# Altium schematic sheet CAN_Transceiver.SchDoc
size A
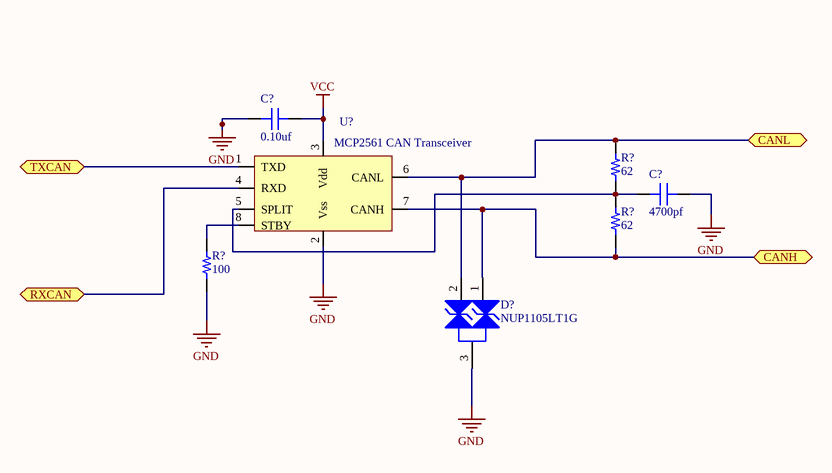
[diagram p0: CAN_Transceiver.SchDoc]

## Parts
(Parts that share a designator on the sheet are numbered #1, #2 ... from top to bottom, then left to right.)
C?#1  value 0.10uf  [CAP 0603/1608]  (hidden comment: Capacitor MLCC 0.10uf 50V CAP 0603/1608)
C?#2  value 4700pf  [CAP 0603/1608]  (hidden comment: Capacitor MLCC 4700pf 50V CAP 0603/1608)
D?  NUP1105LT1G  [SOT-23 (TO-236)]
R?#1  value 62  [RES 0603/1608]  (hidden comment: Resistor 62 0603 1/10W 5%)
R?#2  value 62  [RES 0603/1608]  (hidden comment: Resistor 62 0603 1/10W 5%)
R?#3  value 100  [RES 0603/1608]  (hidden comment: Resistor 100 0603 1/10W 10%)
U?  MCP2561 CAN Transceiver  [SOIC-8]

## Ports
CANH (bidir), CANL (bidir), RXCAN (bidir), TXCAN (bidir)

## Nets
GND: C?#1.1 C?#2.1 D?.3(K) R?#3.1 U?.2(Vss)
VCC: C?#1.2 U?.3(Vdd)
CANH: D?.1(K) R?#2.2 U?.7(CANH) ; port CANH
CANL: D?.2(K) R?#1.1 U?.6(CANL) ; port CANL
RXCAN: U?.4(RXD) ; port RXCAN
TXCAN: U?.1(TXD) ; port TXCAN
NetC?#2_2: C?#2.2 R?#1.2 R?#2.1 U?.5(SPLIT)
NetR?#3_2: R?#3.2 U?.8(STBY)

## Library data of the parts
C?#1 = 943: Manufacturer_id: 1; idCapacitor: 943; Name: Cap_0.10uf_50V_CAP 0603/1608; Dielectric: Ceramic; Created_By: Nick Mah; Drawer_id: 1; Voltage_Rating: 50V; Package: CAP 0603/1608; Created_Date: 10/20/2018
C?#2 = 929: Manufacturer_id: 1; idCapacitor: 929; Name: Cap_4700pf_50V_CAP 0603/1608; Dielectric: Ceramic; Created_By: Nick Mah; Drawer_id: 1; Voltage_Rating: 50V; Package: CAP 0603/1608; Created_Date: 10/20/2018
D? = 7: ESD Protection Diode; Manufacturer_id: 1; idDiode: 7; Name: SOT-23_350W_Zener; Value: TVS_24V; Type: Zener; Ic: 8A; Power: 350W; Drawer_id: 1; Num_Circuits: 1; Package: SOT-23; MfrPartNo: NUP1105LT1G; Link: https://www.digikey.com/product-detail/en/on-semiconductor/NUP1105LT1G/NUP1105LT1GOSCT-ND/2122067; ComponentLink1URL: https://www.digikey.com/product-detail/en/on-semiconductor/NUP1105LT1G/NUP1105LT1GOSCT-ND/2122067; Supplier1: Digikey; Supplier1PartNo: NUP1105LT1GOSCT-ND
R?#1 R?#2 = 1340: Manufacturer_id: 1; idResistor: 1340; Name: Res_62_0603_1/10W_5%; Created_By: Nick Mah; Supplier 1: Digi-Key; Drawer_id: 1; Tolerance: 5%; Power: 1/10W; Package: 0603; ComponentLink1Description: Datasheet; Created_Date: 2018-10-20
R?#3 = 2293: Manufacturer_id: 1; idResistor: 2293; Name: Res_100_0603_1/10W_10%; Created_By: Nick Mah; Supplier 1: Digi-Key; Drawer_id: 1; Tolerance: 10%; Power: 1/10W; Package: 0603; ComponentLink1Description: Datasheet; Created_Date: 2018-10-20
U? = 5: Manufacturer_id: 1; idIC_Interface: 5; Value: CAN/UART; Data_Rate: 1Mbps; Vin(Min): 4.5V; Vin(Max): 5.5V; Created_By: Angel Delgado; Drawer_id: 1; Name: CAN Transceiver; Type: Transceiver; Protocol: CAN; Num_Circuits: 1; Package: SOIC-8; MfrPartNo: MCP2561; Link: https://www.digikey.com/product-detail/en/microchip-technology/MCP2561T-E-SN/MCP2561T-E-SNCT-ND/5148846